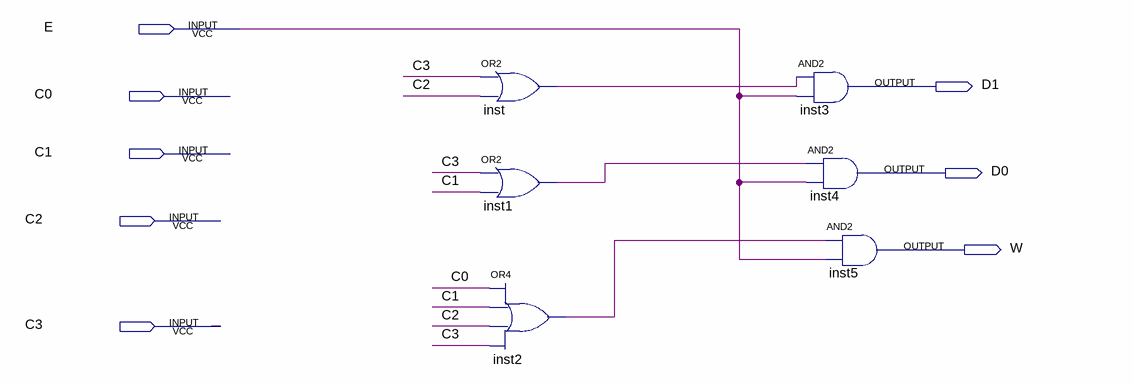
[diagram p0: schematic sheet]
// Quartus schematic MojCD.bdf as structural Verilog: 6 symbols, 8 pins
module MojCD (
  input  E,
  input  C0,
  input  C1,
  input  C2,
  input  C3,
  output D1,
  output D0,
  output W
);

  wire inst1_out, inst2_out, inst_out;

  or inst (inst_out, C3, C2);
  or inst1 (inst1_out, C3, C1);
  or inst2 (inst2_out, C0, C1, C2, C3);
  and inst3 (D1, inst_out, E);
  and inst4 (D0, inst1_out, E);
  and inst5 (W, inst2_out, E);
endmodule
